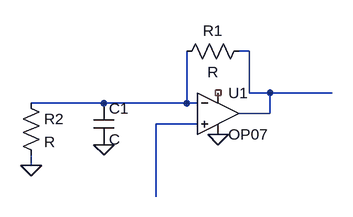
[diagram p0: schematic HPF.asc]
HPF.asc, the LTspice schematic file:
Version 4
SHEET 1 880 680
WIRE 400 80 384 80
WIRE 400 144 400 80
WIRE 432 144 400 144
WIRE 528 144 432 144
WIRE 176 160 64 160
WIRE 304 160 304 80
WIRE 304 160 176 160
WIRE 320 160 304 160
WIRE 432 176 432 144
WIRE 432 176 384 176
WIRE 320 192 256 192
WIRE 64 256 64 240
WIRE 256 304 256 192
FLAG 64 256 0
FLAG 176 224 0
FLAG 352 208 0
SYMBOL OpAmps\\OP07 352 112 R0
SYMATTR InstName U1
SYMBOL res 400 64 R90
WINDOW 0 0 56 VBottom 2
WINDOW 3 32 56 VTop 2
SYMATTR InstName R1
SYMBOL res 48 144 R0
SYMATTR InstName R2
SYMBOL cap 160 160 R0
SYMATTR InstName C1

The netlist it stands for:
* HPF.asc
XU1 N003 N002 NC_01 0 N001 LT1001  ; OP07, pins In+ In- V+ V- OUT
R1 N001 N002 R
R2 N002 0 R
C1 N002 0 C
.lib LTC.lib
.backanno
.end